# EAGLE schematic mutteruhr-Haus (EAGLE 7.7.0)
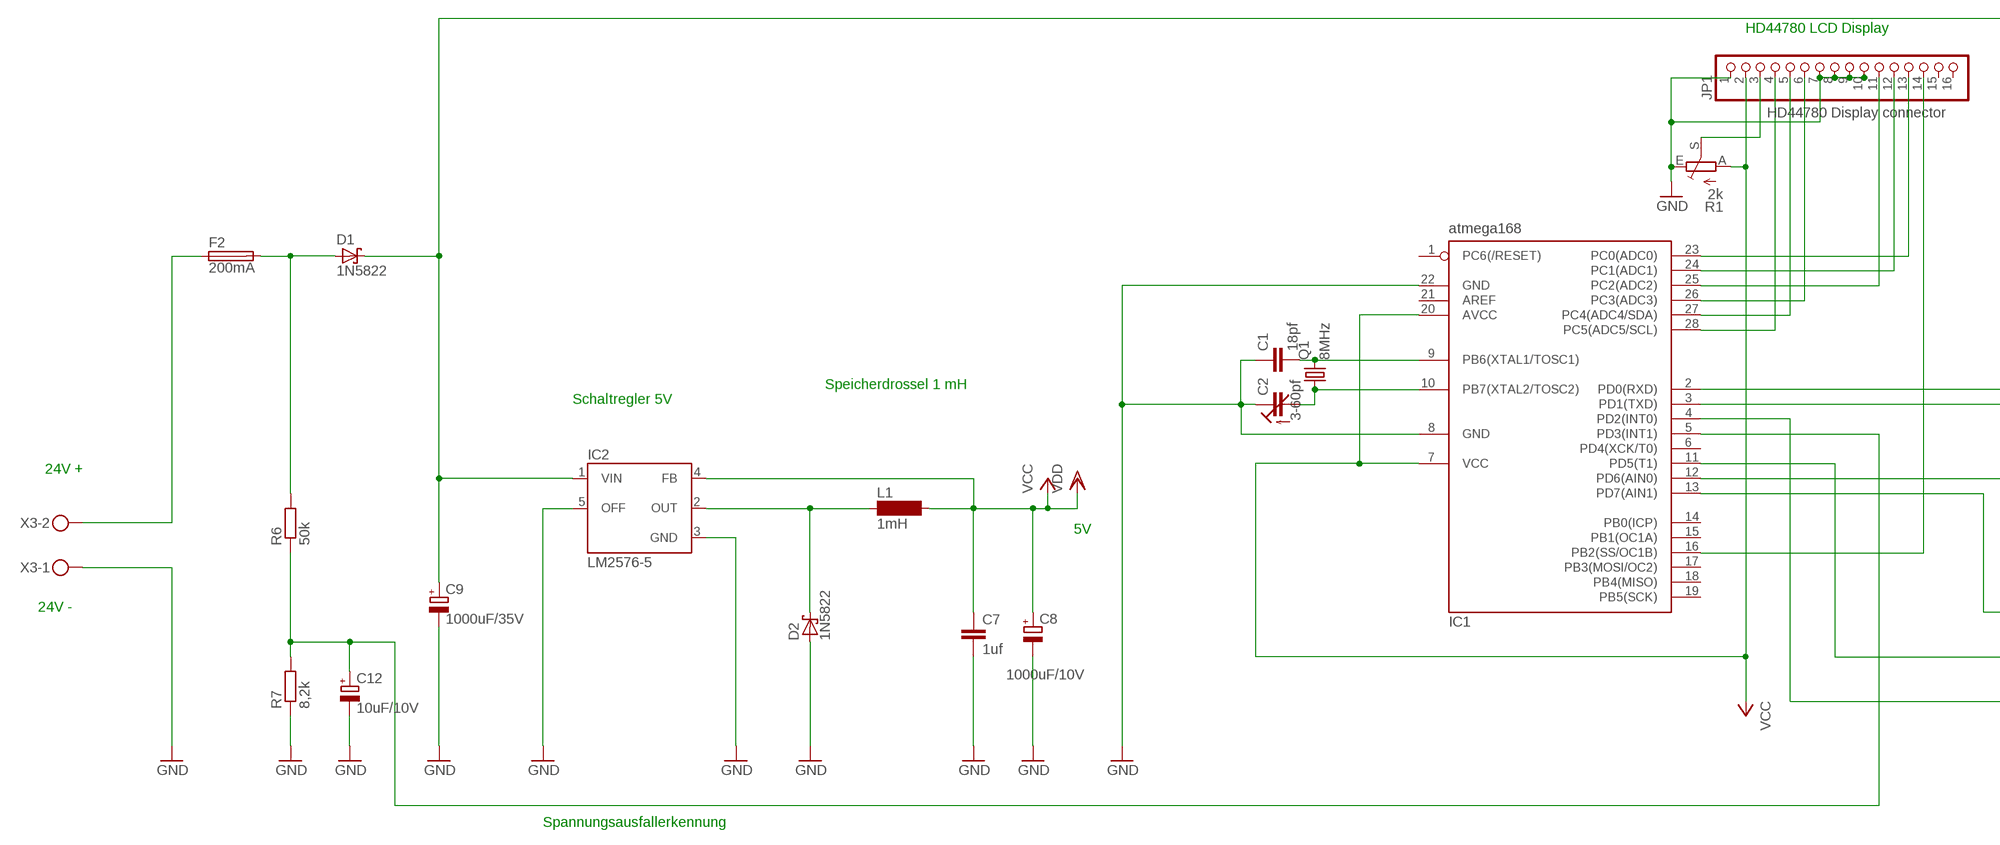
[diagram p0: schematic, sheet 1, part 1 of 2]
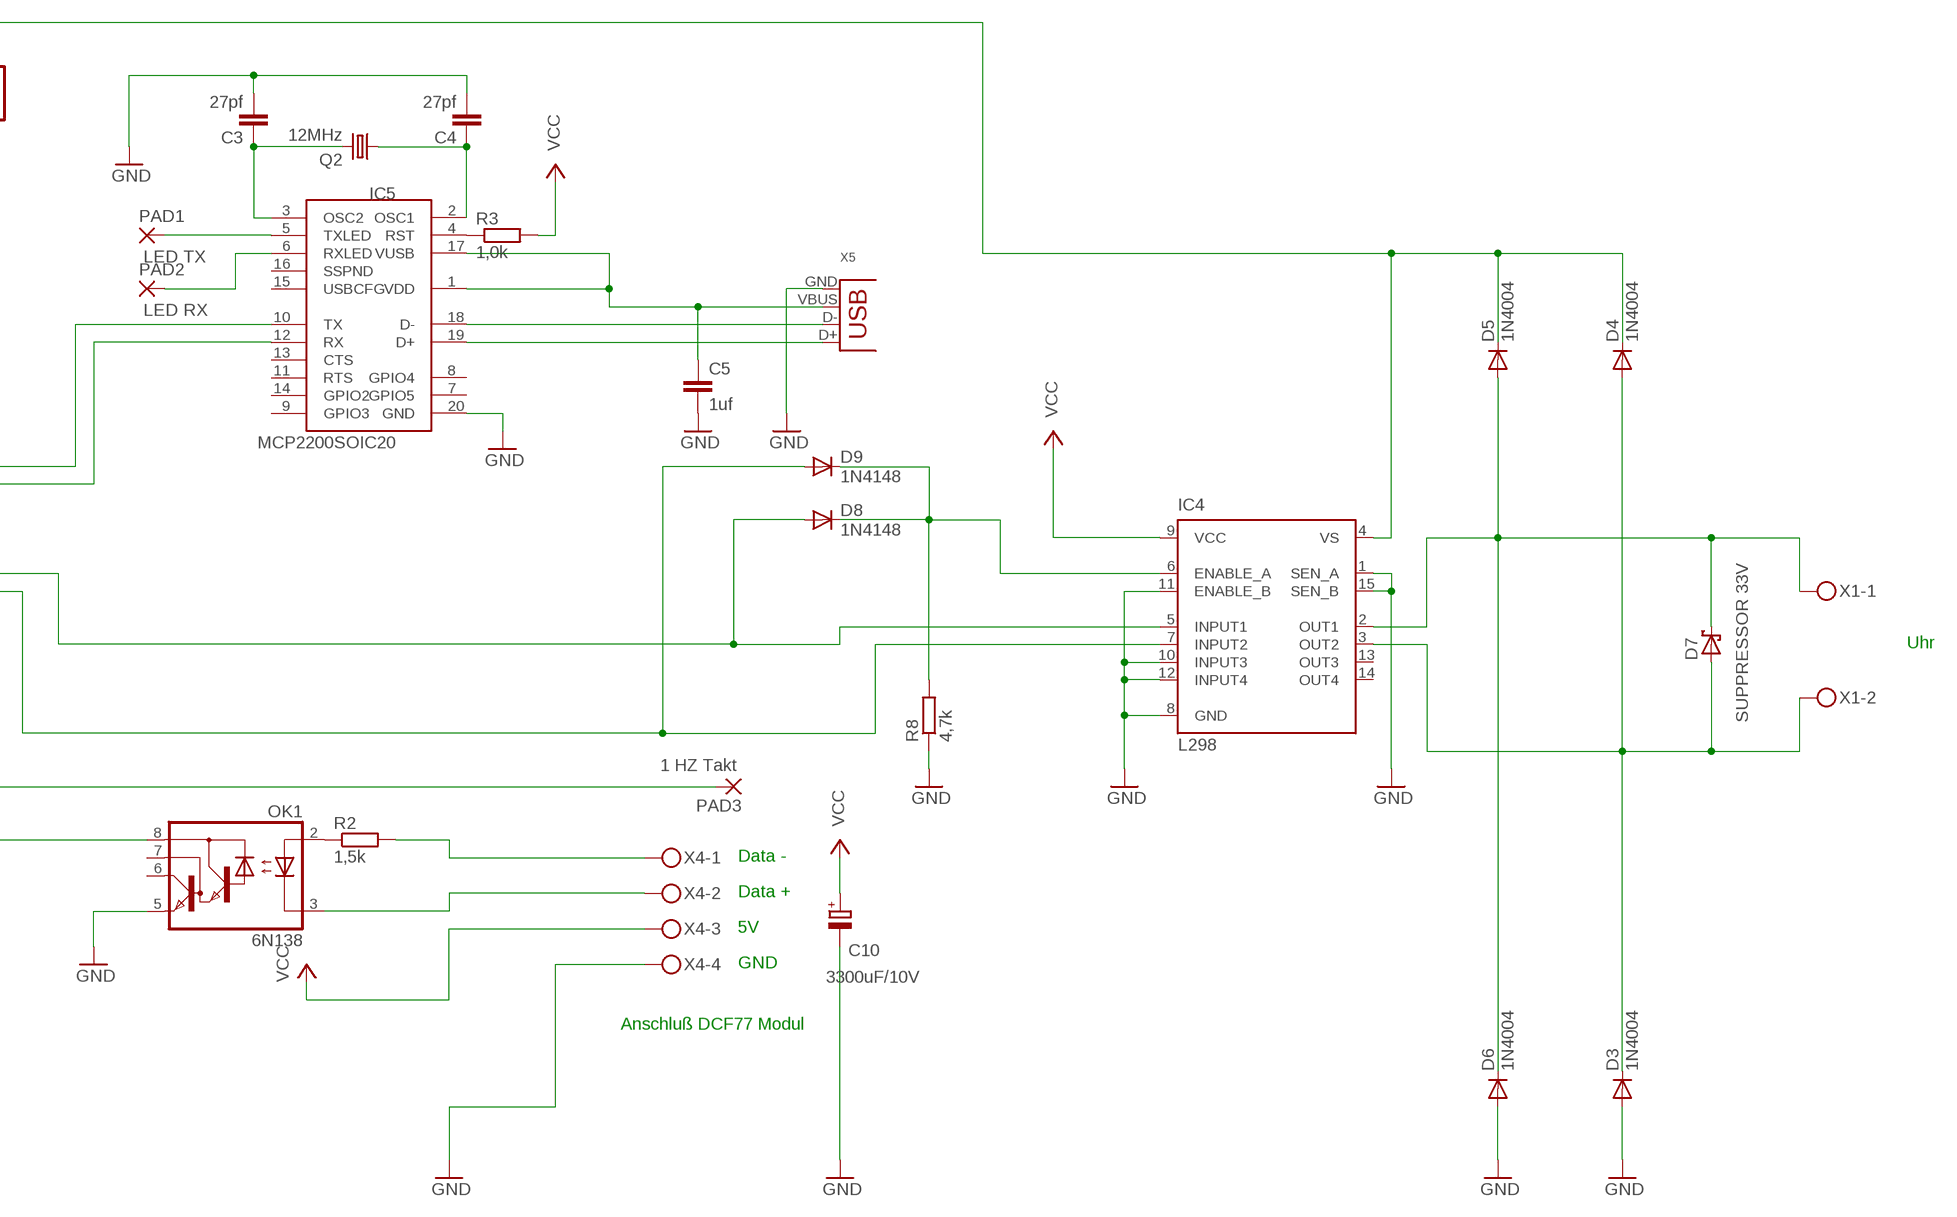
[diagram p1: schematic, sheet 1, part 2 of 2]

## Parts
C1  18pf  C-EU050-024X044  [C050-024X044]
C2  3-60pf  C-TRIMM3050.505  [CTRIM3050.505]
C3  27pf  C-EU050-024X044  [C050-024X044]
C4  27pf  C-EU050-024X044  [C050-024X044]
C5  1uf  C5/5.5  [C5B5.5]
C7  1uf  C5/5.5  [C5B5.5]
C8  1000uF/10V  CPOL-EUE5-8.5  [E5-8,5]
C9  1000uF/35V  CPOL-EUE5-8.5  [E5-8,5]
C10  3300uF/10V  CPOL-EUE7.5-16  [E7,5-16]
C12  10uF/10V  CPOL-EUE5-5  [E5-5]
D1  1N5822  1N5819-B  [DO41-7.6]
D2  1N5822  1N5819-B  [DO41-7.6]
D3  1N4004  [DO41-10]
D4  1N4004  [DO41-10]
D5  1N4004  [DO41-10]
D6  1N4004  [DO41-10]
D7  SUPPRESSOR 33V  P4KEXX  [DO41-10]
D8  1N4148  1N4148DO35-7  [DO35-7]
D9  1N4148  1N4148DO35-7  [DO35-7]
F2  200mA  SH25  [SH25]
IC1  atmega168  MEGA8-P  [DIL28-3]
IC2  LM2576-5  LM2576T  [TO220-5]
IC4  L298  [MULTIWATT-15]
IC5  MCP2200SOIC20  [SOIC20]
JP1  HD44780 Display connector  PINHD-1X16_2.54  [1X16]
L1  1mH  BS11  [BS11]
OK1  6N138  [DIL08]
PAD1  LED TX  2,54/0,8  [2,54/0,8]
PAD2  LED RX  2,54/0,8  [2,54/0,8]
PAD3  1 HZ Takt  2,54/0,8  [2,54/0,8]
Q1  8MHz  CRYSTALHC18U-V  [HC18U-V]
Q2  12MHz  CRYSTALHC18U-V  [HC18U-V]
R1  2k  TRIM_EU-RS3  [RS3]
R2  1,5k  R-EU_0207/10  [0207/10]
R3  1,0k  R-EU_0207/10  [0207/10]
R6  50k  R-EU_0207/10  [0207/10]
R7  8,2k  R-EU_0207/10  [0207/10]
R8  4,7k  R-EU_0207/10  [0207/10]
X1  MKDSN1,5/2-5,08  [MKDSN1,5/2-5,08]
X3  MKDSN1,5/2-5,08  [MKDSN1,5/2-5,08]
X4  MKDSN1,5/4-5,08  [MKDSN1,5/4-5,08]
X5  USB-B-H  [USB-B-H]

## Nets
GND: C1.1 C2.1(E) C3.2 C4.2 C5.2 C7.2 C8.- C9.- C10.- C12.- D2.A D3.A D6.A IC1.8(GND) IC1.22(GND) IC2.3(GND) IC2.5(OFF) IC4.1(SEN_A) IC4.8(GND) IC4.10(INPUT3) IC4.11(ENABLE_B) IC4.12(INPUT4) IC4.15(SEN_B) IC5.20(GND) JP1.1 JP1.7 JP1.8 JP1.9 JP1.10 OK1.5(GND) R1.E R7.1 R8.1 X3.1 X4.4 X5.GND
N$1: IC1.4(PD2(INT0)) OK1.8(VCC)
N$2: C1.2 IC1.9(PB6(XTAL1/TOSC1)) Q1.2
N$3: C2.2(A) IC1.10(PB7(XTAL2/TOSC2)) Q1.1
N$4: IC1.23(PC0(ADC0)) JP1.13
N$5: IC1.24(PC1(ADC1)) JP1.12
N$6: IC1.25(PC2(ADC2)) JP1.11
N$7: IC1.26(PC3(ADC3)) JP1.6
N$8: IC1.27(PC4(ADC4/SDA)) JP1.5
N$9: IC1.28(PC5(ADC5/SCL)) JP1.4
N$10: IC1.16(PB2(SS/OC1B)) JP1.14
N$11: IC5.18(D-) X5.D-
N$12: JP1.3 R1.S
N$13: IC5.19(D+) X5.D+
N$14: IC1.2(PD0(RXD)) IC5.10(TX)
N$15: IC1.3(PD1(TXD)) IC5.12(RX)
N$17: IC5.4(RST) R3.1
N$18: C3.1 IC5.3(OSC2) Q2.2
N$19: C4.1 IC5.2(OSC1) Q2.1
N$20: IC5.6(RXLED) PAD2.1(P)
N$21: IC5.5(TXLED) PAD1.1(P)
N$22: D9.A IC1.13(PD7(AIN1)) IC4.7(INPUT2)
N$23: OK1.2(A) R2.1
N$24: C5.1 IC5.1(VDD) IC5.17(VUSB) X5.VBUS
N$25: IC1.11(PD5(T1)) PAD3.1(P)
N$26: D1.A F2.2 R6.2
N$27: OK1.3(C) X4.2
N$28: C9.+ D1.C D4.C D5.C IC2.1(VIN) IC4.4(VS)
N$29: F2.1 X3.2
N$32: R2.2 X4.1
N$33: C12.+ IC1.5(PD3(INT1)) R6.1 R7.2
N$39: D2.C IC2.2(OUT) L1.1
N$41: D8.C D9.C IC4.6(ENABLE_A) R8.2
N$43: D3.C D4.A D7.A IC4.3(OUT2) X1.2
N$44: D8.A IC1.12(PD6(AIN0)) IC4.5(INPUT1)
N$56: D5.A D6.C D7.C IC4.2(OUT1) X1.1
VCC: C7.1 C8.+ C10.+ IC1.7(VCC) IC1.20(AVCC) IC2.4(FB) IC4.9(VCC) JP1.2 L1.2 R1.A R3.2 X4.3 ; supply symbol labelled VDD
Unconnected: IC1.1(PC6(/RESET)) IC1.6(PD4(XCK/T0)) IC1.14(PB0(ICP)) IC1.15(PB1(OC1A)) IC1.17(PB3(MOSI/OC2)) IC1.18(PB4(MISO)) IC1.19(PB5(SCK)) IC1.21(AREF) IC4.13(OUT3) IC4.14(OUT4) IC5.7(GPIO5) IC5.8(GPIO4) IC5.9(GPIO3) IC5.11(RTS) IC5.13(CTS) IC5.14(GPIO2) IC5.15(USBCFG) IC5.16(SSPND) JP1.15 JP1.16 OK1.6(VO) OK1.7(VB)

## Notes on the sheet
- HD44780 LCD Display
- Speicherdrossel 1 mH
- Schaltregler 5V
- 24V +
- 5V
- Uhr
- 24V -
- Data -
- Data +
- 5V
- GND
- Spannungsausfallerkennung
- Anschluß DCF77 Modul

## Library data of the parts
C1 C3 C4 = rcl:C-EU: CAPACITOR, European symbol
C2 = rcl:C-TRIMM: Trimm capacitor
C5 C7 = capacitor-wima:C: CAPACITOR naming: grid - package width
C8-C10 = rcl:CPOL-EU: POLARIZED CAPACITOR, European symbol
C12 = rcl-2:CPOL-EU: POLARIZED CAPACITOR, European symbol
D1 D2 = diode:1N581*: 1.0A SCHOTTKY BARRIER RECTIFIER Source: http://www.diodes.com/datasheets/ds23001.pdf
D3-D6 = diode:1N4004: DIODE general purpose rectifier, 1 A
D7 = diode:P4KEXX: DIODE transient-voltage suppressor
D8 D9 = diode:1N4148: DIODE high speed (Philips)
F2 = fuse:SH25: FUSE HOLDER grid 25 mm, OGN0031 8211, Schurter (Buerklin); MF: SCHURTER; MPN: 0031.8211; OC_FARNELL: 1162741; OC_NEWARK: 96B9380
IC1 = atmel:MEGA8-P: MICROCONTROLLER 8 Kbytes FLASH, 1 kbytes SRAM, 512 bytes EEPROM, USART, 4-channel 10 bit ADC, 2-channel 8 bit ADC Pin compatible with Atmega48, ATMega88, ATMega168 Source: avr.lbr
IC2 = v-reg-3:LM2576: National Semiconductor <http://www.national.com> 3.0A "Simple Switcher"(c) 52kHz, Vout 1.23-37V (HV: 57V), Vin 40V (HV: 60V), 50µA standby current
IC4 = st-microelectronics:L298: DUAL FULL-BRIDGE DRIVER; MPN: L298N; OC_FARNELL: 1589425; OC_NEWARK: 32M1527
IC5 = microchip-update-2:MCP2200: USB 2.0 to UART Protocol Converter with GPIO
JP1 = pinhead-2:PINHD-1X16: PIN HEADER
L1 = inductor-neosid:BS: INDUCTOR nominal inductance, magnetically screened; OC_FARNELL: unknown; OC_NEWARK: unknown
OK1 = optocoupler:6N138: MOTOROLA OPTO COUPLER; MF: VISHAY/TELEFUNKEN; MPN: 6N138; OC_FARNELL: 9860150; OC_NEWARK: 35K5294
PAD1-PAD3 = wirepad:2,54/0,8: THROUGH-HOLE PAD
Q1 Q2 = crystal:CRYSTAL: CRYSTAL
R1 = pot:TRIM_EU-: POTENTIOMETER
R2 R3 R6-R8 = resistor:R-EU_: RESISTOR, European symbol
X1 X3 = con-phoenix-508:MKDSN1,5/2-5,08: MKDSN 1,5/ 2-5,08 Printklemme Nennstrom: 13,5 A Nennspannung: 250 V Rastermaß: 5,08 mm Polzahl: 2 Anschlussart: Schraubanschluss Montage: Löten Anschlussrichtung Leiter/Platine: 0 ° Artikelnummer: 1729128 Source: http://eshop.phoenixcontact.com .. 1729128.pdf; MPN: MKDSN 1,5/2-5.08; OC_FARNELL: 1792903; OC_NEWARK: 30M2397
X4 = con-phoenix-508:MKDSN1,5/4-5,08: MKDSN 1,5/ 4-5,08 Printklemme Nennstrom: 13,5 A Nennspannung: 250 V Rastermaß: 5,08 mm Polzahl: 4 Anschlussart: Schraubanschluss Montage: Löten Anschlussrichtung Leiter/Platine: 0 ° Artikelnummer: 1729144 Source: http://eshop.phoenixcontact.com .. 1729144.pdf; MPN: SMKDSN1,5/4-5,08; OC_FARNELL: 1792905; OC_NEWARK: 70R0300
X5 = con-usb-3:USB: USB Connectors